# EAGLE design AVR_ProgrammingBoard (EAGLE 7.1.0)
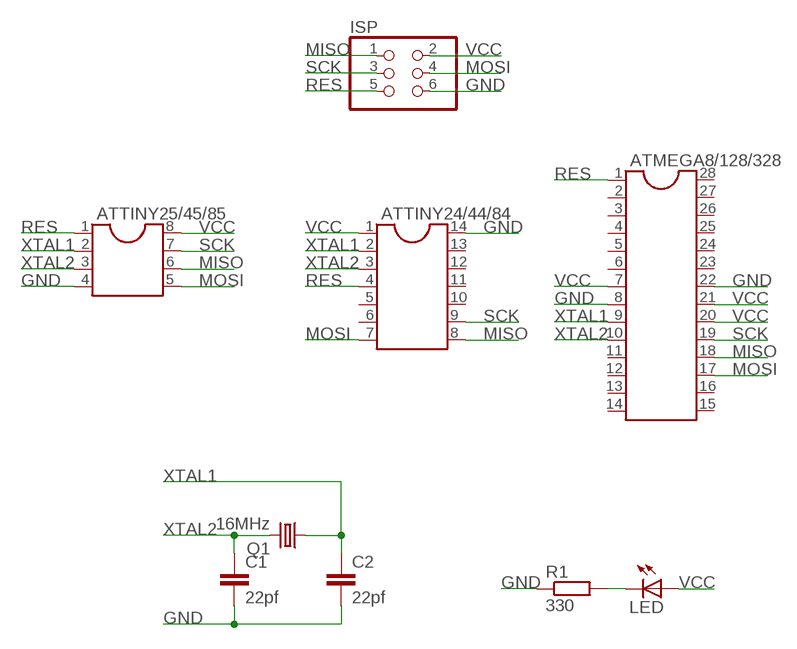
[diagram p0: schematic, sheet 1]

## Parts
ATMEGA8/128/328  DIL28-3  [DIL28-3]
ATTINY24/44/84  DIL14  [DIL14]
ATTINY25/45/85  DIL8  [DIL08]
C1  22pf  C5/3  [C5B3]
C2  22pf  C5/3  [C5B3]
ISP  PINHD-2X3  [2X03]
LED  LED5MM  [LED5MM]
Q1  16MHz  CRYSTALHC49U-V  [HC49U-V]
R1  330  R-EU_0204/7  [0204/7]

## Nets
GND: ATMEGA8/128/328.8 ATMEGA8/128/328.22 ATTINY24/44/84.14 ATTINY25/45/85.4 C1.2 C2.2 ISP.6 R1.1
MISO: ATMEGA8/128/328.18 ATTINY24/44/84.8 ATTINY25/45/85.6 ISP.1
MOSI: ATMEGA8/128/328.17 ATTINY24/44/84.7 ATTINY25/45/85.5 ISP.4
N$1: LED.K(C) R1.2
RES: ATMEGA8/128/328.1 ATTINY24/44/84.4 ATTINY25/45/85.1 ISP.5
SCK: ATMEGA8/128/328.19 ATTINY24/44/84.9 ATTINY25/45/85.7 ISP.3
VCC: ATMEGA8/128/328.7 ATMEGA8/128/328.20 ATMEGA8/128/328.21 ATTINY24/44/84.1 ATTINY25/45/85.8 ISP.2 LED.A
XTAL1: ATMEGA8/128/328.9 ATTINY24/44/84.2 ATTINY25/45/85.2 C2.1 Q1.1
XTAL2: ATMEGA8/128/328.10 ATTINY24/44/84.3 ATTINY25/45/85.3 C1.1 Q1.2
Unconnected: ATMEGA8/128/328.2 ATMEGA8/128/328.3 ATMEGA8/128/328.4 ATMEGA8/128/328.5 ATMEGA8/128/328.6 ATMEGA8/128/328.11 ATMEGA8/128/328.12 ATMEGA8/128/328.13 ATMEGA8/128/328.14 ATMEGA8/128/328.15 ATMEGA8/128/328.16 ATMEGA8/128/328.23 ATMEGA8/128/328.24 ATMEGA8/128/328.25 ATMEGA8/128/328.26 ATMEGA8/128/328.27 ATMEGA8/128/328.28 ATTINY24/44/84.5 ATTINY24/44/84.6 ATTINY24/44/84.10 ATTINY24/44/84.11 ATTINY24/44/84.12 ATTINY24/44/84.13

## Library data of the parts
ATMEGA8/128/328 = ic-package:DIL28: Dual In Line
ATTINY24/44/84 = ic-package:DIL14: Dual In Line / Socket
ATTINY25/45/85 = ic-package:DIL8: Dual In Line / Socket
C1 C2 = capacitor-wima:C: CAPACITOR naming: grid - package width
ISP = pinhead:PINHD-2X3: PIN HEADER
LED = led:LED: LED OSRAM: - CHIPLED LG R971, LG N971, LY N971, LG Q971, LY Q971, LO R971, LY R971 LH N974, LH R974 LS Q976, LO Q976, LY Q976 LO Q996 - Hyper CHIPLED LW Q18S LB Q993, LB Q99A, LB R99A - SideLED LS A670, LO A670, LY A670, LG A670, LP A670 LB A673, LV A673, LT A673, LW A673 LH A674 LY A675 LS A676, LA A676, LO A676, LY A676, LW A676 LS A679, LY A679, LG A679 - Hyper Micro SIDELED® LS Y876, LA Y876, LO Y876, LY Y876 LT Y87S - SmartLED LW L88C, LW L88S LB L89C, LB L89S, LG L890 LS L89K, LO L89K, LY L89K LS L896, LA L896, LO L896, LY L896 - TOPLED LS T670, LO T670, LY T670, LG T670, LP T670 LSG T670, LSP T670, LSY T670, LOP T670, LYG T670 LG T671, LOG T671, LSG T671 LB T673, LV T673, LT T673, LW T673 LH T674 LS T676, LA T676, LO T676, LY T676, LB T676, LH T676, LSB T676, LW T676 LB T67C, LV T67C, LT T67C, LS T67K, LO T67K, LY T67K, LW E67C LS E67B, LA E67B, LO E67B, LY E67B, LB E67C, LV E67C, LT E67C LW T67C LS T679, LY T679, LG T679 LS T770, LO T770, LY T770, LG T770, LP T770 LB T773, LV T773, LT T773, LW T773 LH T774 LS E675, LA E675, LY E675, LS T675 LS T776, LA T776, LO T776, LY T776, LB T776 LHGB T686 LT T68C, LB T68C - Hyper Mini TOPLED® LB M676 - Mini TOPLED Santana® LG M470 LS M47K, LO M47K, LY M47K Source: http://www.osram.convergy.de LUXEON: - LUMILED® LXK2-PW12-R00, LXK2-PW12-S00, LXK2-PW14-U00, LXK2-PW14-V00 LXK2-PM12-R00, LXK2-PM12-S00, LXK2-PM14-U00 LXK2-PE12-Q00, LXK2-PE12-R00, LXK2-PE12-S00, LXK2-PE14-T00, LXK2-PE14-U00 LXK2-PB12-K00, LXK2-PB12-L00, LXK2-PB12-M00, LXK2-PB14-N00, LXK2-PB14-P00, LXK2-PB14-Q00 LXK2-PR12-L00, LXK2-PR12-M00, LXK2-PR14-Q00, LXK2-PR14-R00 LXK2-PD12-Q00, LXK2-PD12-R00, LXK2-PD12-S00 LXK2-PH12-R00, LXK2-PH12-S00 LXK2-PL12-P00, LXK2-PL12-Q00, LXK2-PL12-R00 Source: www.luxeon.com KINGBRIGHT: KA-3528ASYC Source: www.kingbright.com
Q1 = crystal:CRYSTAL: CRYSTAL; OC_FARNELL: 1666969; OC_NEWARK: unknown
R1 = rcl:R-EU_: RESISTOR, European symbol

## Board
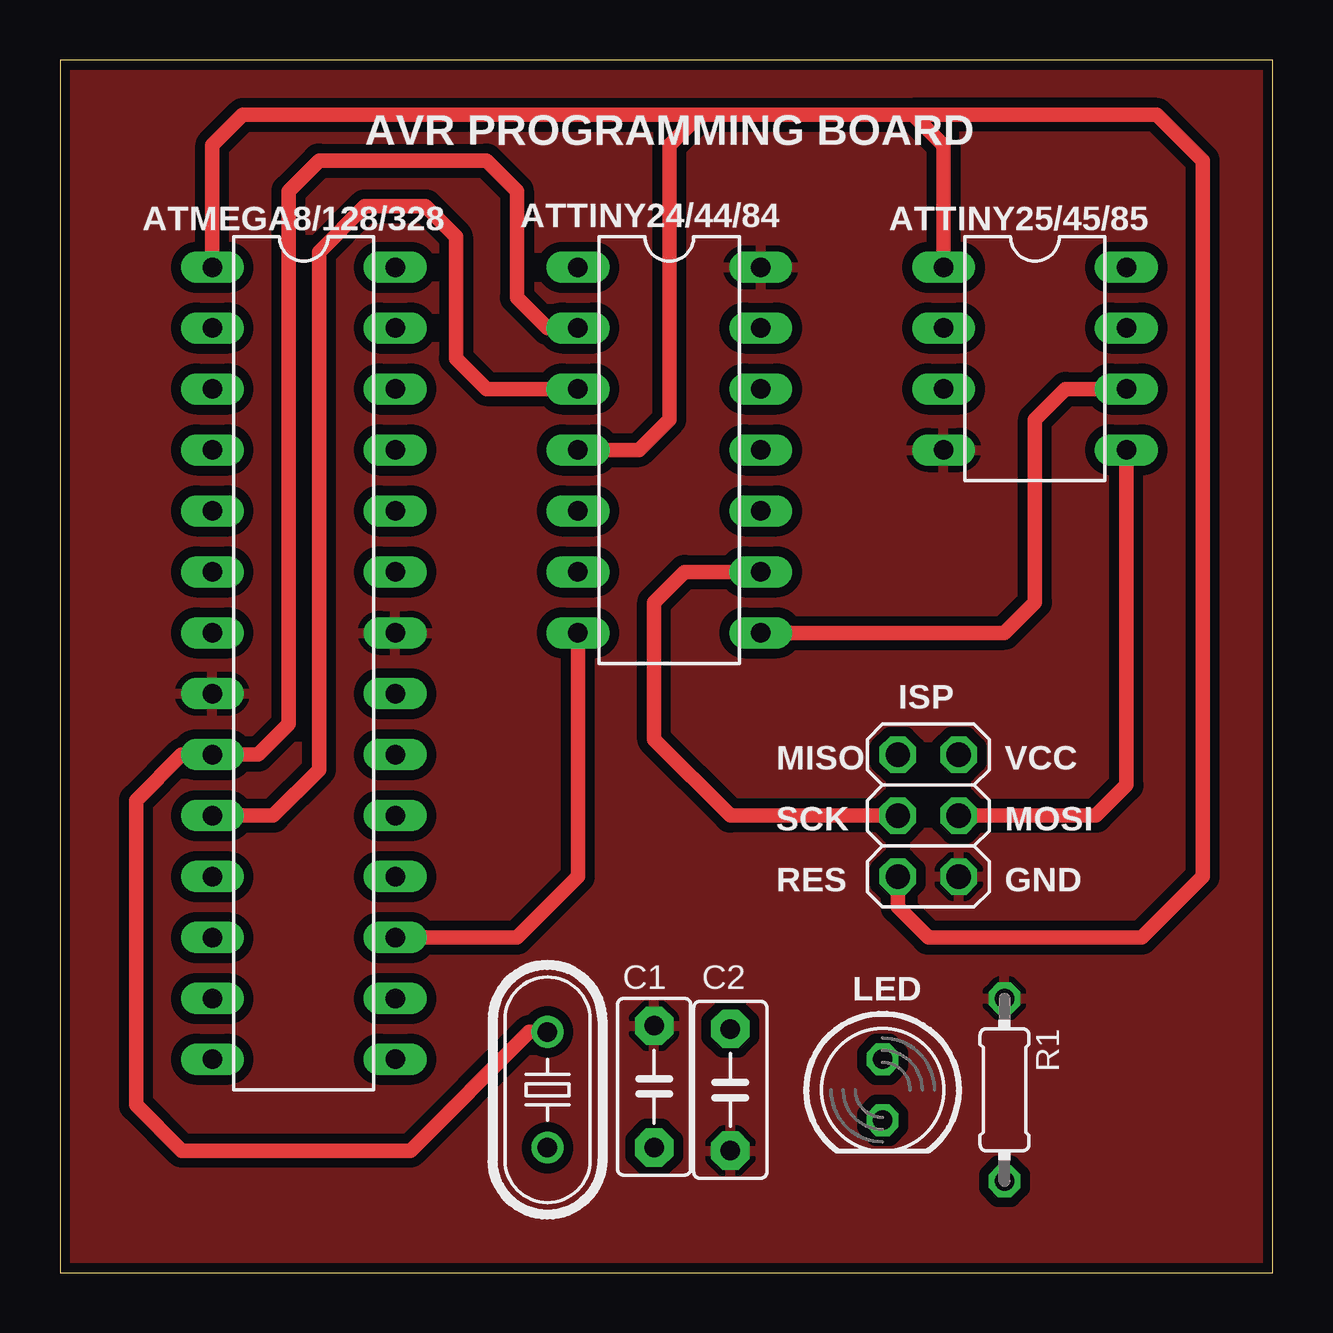
[diagram p1: board, top side]
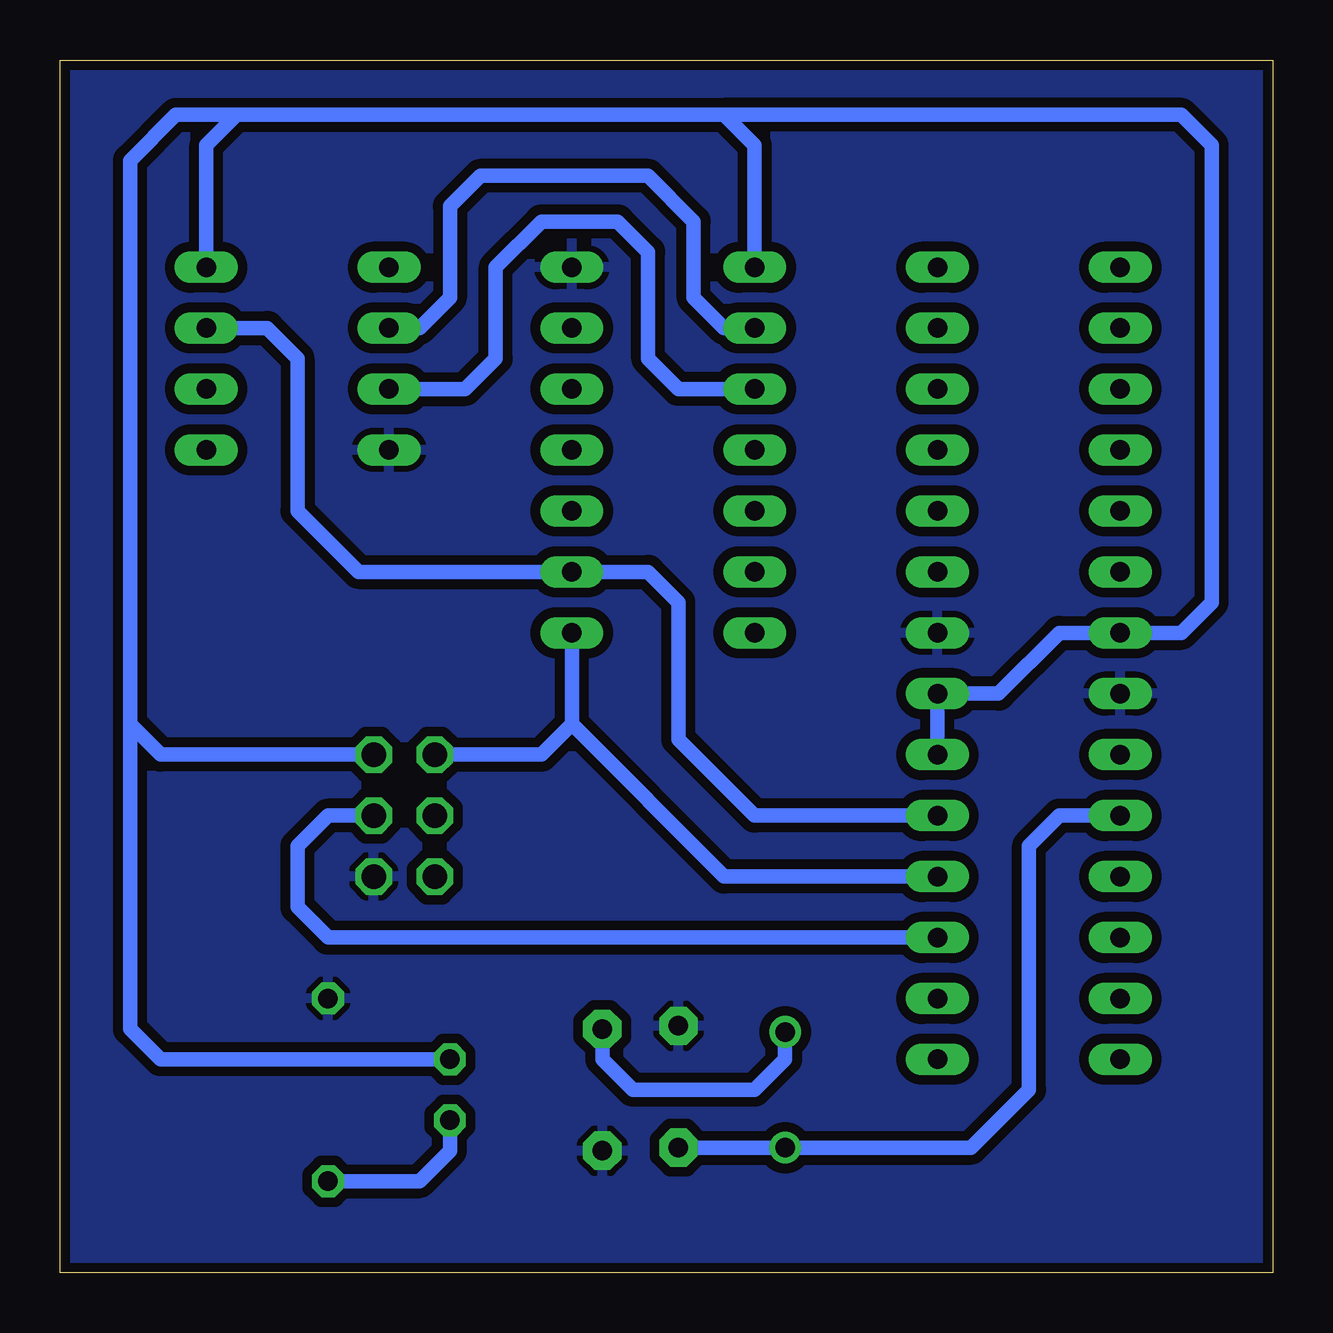
[diagram p2: board, bottom side, seen from below]

Size 50.55 x 50.55 mm. Coordinates in mm from the lower left corner, seen from the top.
Outline: 0,0 50.55,0 50.55,50.55 0,50.55 0,0
Copper layers (1*16): Top 0.035mm / dielectric 1.5mm / Bottom 0.035mm
Design rules "dirt_cheap_dirty_boards.v1": minimum track width 5mil, minimum drill 12mil, track to track 5mil, track to pad 5mil, pad to pad 5mil, via to via 5mil, smd to smd 0mil, copper to edge 10mil, drill to drill 10mil, minimum pad ring 10mil, minimum via ring 6mil, stop-mask expansion 2mil, vias tented up to drill 25mil, thermal gap 10mil

### Footprints (pad centres in the part's own frame; a part is rotated, then mirrored left to right if it is on the bottom)
DIL28-3 = drill 0.813 long: 1 -16.51,-3.81; 2 -13.97,-3.81; 3 -11.43,-3.81; 4 -8.89,-3.81; 5 -6.35,-3.81; 6 -3.81,-3.81; 7 -1.27,-3.81; 8 1.27,-3.81; 9 3.81,-3.81; 10 6.35,-3.81; 11 8.89,-3.81; 12 11.43,-3.81; 13 13.97,-3.81; 14 16.51,-3.81; 15 16.51,3.81; 16 13.97,3.81; 17 11.43,3.81; 18 8.89,3.81; 19 6.35,3.81; 20 3.81,3.81; 21 1.27,3.81; 22 -1.27,3.81; 23 -3.81,3.81; 24 -6.35,3.81; 25 -8.89,3.81; 26 -11.43,3.81; 27 -13.97,3.81; 28 -16.51,3.81
DIL14 = drill 0.813 long: 1 -7.62,-3.81; 2 -5.08,-3.81; 3 -2.54,-3.81; 4 0,-3.81; 5 2.54,-3.81; 6 5.08,-3.81; 7 7.62,-3.81; 8 7.62,3.81; 9 5.08,3.81; 10 2.54,3.81; 11 0,3.81; 12 -2.54,3.81; 13 -5.08,3.81; 14 -7.62,3.81
DIL08 = drill 0.813 long: 1 -3.81,-3.81; 2 -1.27,-3.81; 3 1.27,-3.81; 4 3.81,-3.81; 5 3.81,3.81; 6 1.27,3.81; 7 -1.27,3.81; 8 -3.81,3.81
C5B3 = drill 0.813 pad 1.6 octagon: 1 -2.54,0; 2 2.54,0
2X03 = drill 1.016 octagon: 1 -2.54,-1.27; 2 -2.54,1.27; 3 0,-1.27; 4 0,1.27; 5 2.54,-1.27; 6 2.54,1.27
LED5MM = drill 0.813 octagon: A -1.27,0; K 1.27,0
HC49U-V = drill 0.813: 1 -2.413,0; 2 2.413,0
0204/7 = drill 0.813 octagon: 1 -3.81,0; 2 3.81,0

### Placement (x,y rotation side)
ATMEGA8/128/328  10.16,25.4 270 top
ATTINY24/44/84  25.4,34.29 270 top
ATTINY25/45/85  40.64,38.1 270 top
C1  24.77,7.75 90 top
C2  27.94,7.62 270 top
ISP  36.2,19.05 270 top
LED  34.29,7.62 270 top
Q1  20.32,7.62 270 top
R1  39.37,7.62 270 top

### Tracks (layer width: path | path; a pad name or v marks a point on that pad's centre or on a via)
GND
  pour Bottom (isolate 0.406): 0,0 50.55,0 50.55,50.55 0,50.55
  pour Top (isolate 0.406): 0,0 50.55,0 50.55,50.55 0,50.55
MISO
  Top 0.61: ATTINY25/45/85.6 41.91,36.83 40.64,35.56 40.64,27.94 39.37,26.67 ATTINY24/44/84.8
  Bottom 0.61: ATMEGA8/128/328.18 22.86,16.51 29.21,22.86 | ISP.1 30.48,21.59 29.21,22.86 | 29.21,22.86 ATTINY24/44/84.8
MOSI
  Top 0.61: ATMEGA8/128/328.17 19.05,13.97 21.59,16.51 ATTINY24/44/84.7 | ISP.4 43.18,19.05 44.45,20.32 ATTINY25/45/85.5
  Bottom 0.61: ATMEGA8/128/328.17 39.37,13.97 40.64,15.24 40.64,17.78 39.37,19.05 ISP.4
N$1
  Bottom 0.61: R1.2 35.56,3.81 34.29,5.08 LED.K
RES
  Top 0.61: ATMEGA8/128/328.1 6.35,46.99 7.62,48.26 26.67,48.26 | 26.67,48.26 35.56,48.26 | 35.56,48.26 36.83,46.99 ATTINY25/45/85.1 | 35.56,48.26 45.72,48.26 47.62,46.35 47.62,16.51 45.09,13.97 36.2,13.97 34.92,15.24 ISP.5 | ATTINY24/44/84.4 24.13,34.29 25.4,35.56 25.4,46.99 26.67,48.26
SCK
  Top 0.61: ISP.3 27.94,19.05 24.77,22.23 24.77,27.94 26.04,29.21 ATTINY24/44/84.9
  Bottom 0.61: ATTINY25/45/85.7 41.91,39.37 40.64,38.1 40.64,31.75 38.1,29.21 ATTINY24/44/84.9 26.04,29.21 24.77,27.94 24.77,22.23 21.59,19.05 ATMEGA8/128/328.19
VCC
  Bottom 0.61: ATMEGA8/128/328.20 ATMEGA8/128/328.21 11.43,24.13 8.89,26.67 ATMEGA8/128/328.7 3.81,26.67 2.54,27.94 2.54,46.99 3.81,48.26 22.86,48.26 | 43.18,48.26 45.72,48.26 47.62,46.35 47.62,22.86 | 43.18,48.26 22.86,48.26 | 22.86,48.26 21.59,46.99 ATTINY24/44/84.1 | 47.62,22.86 47.62,10.16 46.35,8.89 LED.A | ATTINY25/45/85.8 44.45,46.99 43.18,48.26 | ISP.2 46.35,21.59 47.62,22.86
XTAL1
  Top 0.61: ATTINY24/44/84.2 20.32,39.37 19.05,40.64 19.05,45.09 17.78,46.35 10.79,46.35 9.53,45.09 9.53,22.86 8.26,21.59 ATMEGA8/128/328.9 5.08,21.59 3.17,19.68 3.17,6.99 5.08,5.08 14.61,5.08 19.56,10.03 Q1.1
  Bottom 0.61: ATTINY25/45/85.2 35.56,39.37 34.29,40.64 34.29,44.45 33.02,45.72 26.04,45.72 24.13,43.81 24.13,40.64 22.86,39.37 ATTINY24/44/84.2 | C2.1 27.94,8.89 26.67,7.62 21.59,7.62 20.32,8.89 Q1.1
XTAL2
  Top 0.61: ATTINY24/44/84.3 17.78,36.83 16.51,38.1 16.51,43.18 15.24,44.45 12.7,44.45 10.79,42.55 10.79,20.95 8.89,19.05 ATMEGA8/128/328.10
  Bottom 0.61: ATTINY24/44/84.3 24.77,36.83 26.04,38.1 26.04,42.55 27.3,43.81 30.48,43.81 32.38,41.91 32.38,38.1 33.66,36.83 ATTINY25/45/85.3 | ATMEGA8/128/328.10 8.89,19.05 10.16,17.78 10.16,7.62 12.57,5.21 Q1.2 C1.1

### Text on the board
tNames: AVR PROGRAMMING BOARD | MISO | VCC | SCK | MOSI | RES | GND